# EAGLE design Adafruit 96x64 RGB OLED Breakout v2.0 (EAGLE 6.3)
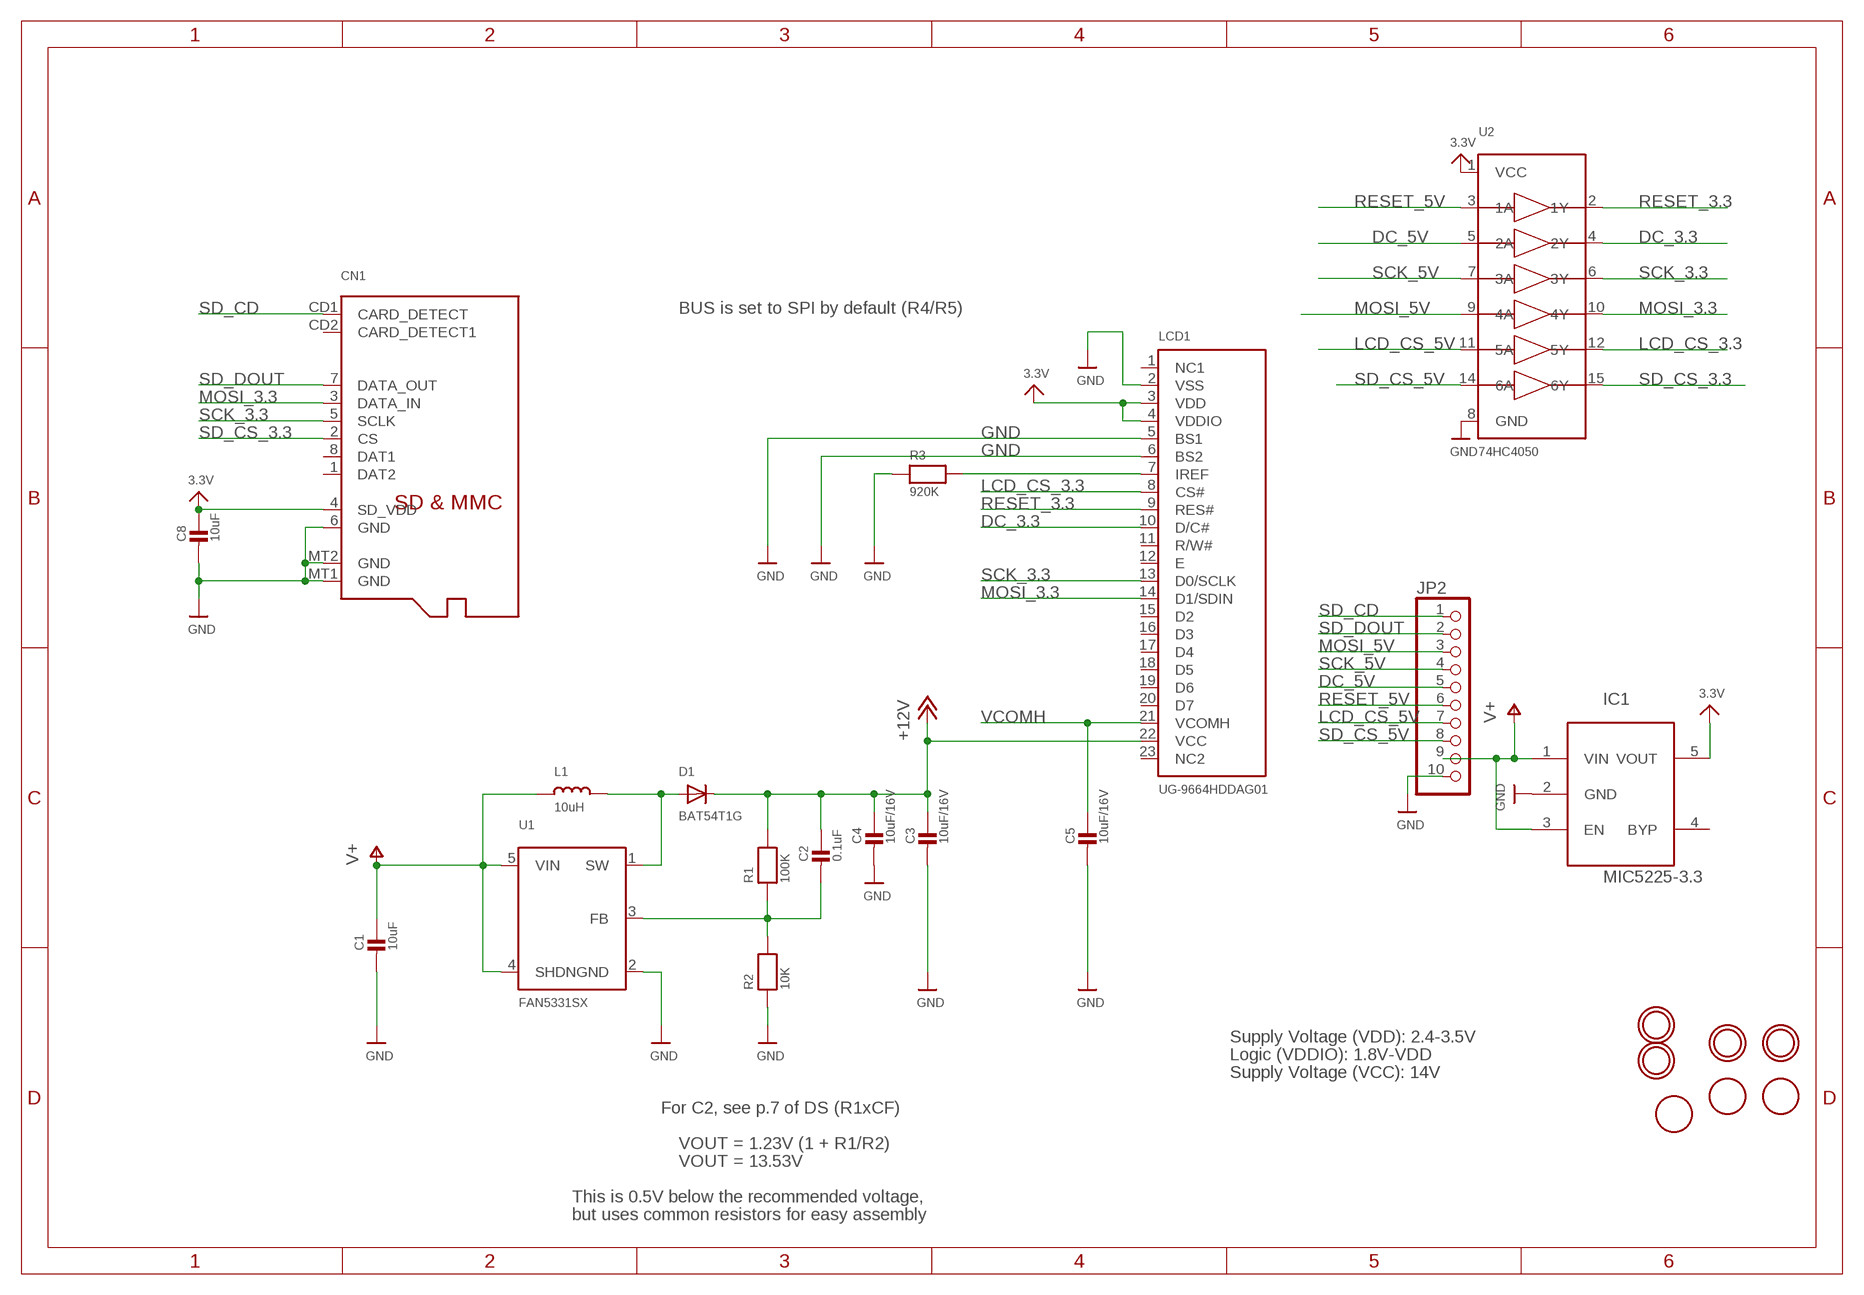
[diagram p0: schematic, sheet 1]

## Parts
C1  10uF  CAP_CERAMIC0805  [0805]
C2  0.1uF  CAP_CERAMIC0805  [0805]
C3  10uF/16V  CAP_CERAMIC0805  [0805]
C4  10uF/16V  CAP_CERAMIC0805  [0805]
C5  10uF/16V  CAP_CERAMIC0805  [0805]
C8  10uF  CAP_CERAMIC0805  [0805]
CN1  MICROSD  [MICROSD]
D1  BAT54T1G  DIODESOD-123  [SOD-123]
IC1  MIC5225-3.3  LP298XS  [SOT23-5L]
JP2  HEADER-1X10THICKER  [1X10_ROUND_76]
L1  10uH  INDUCTOR  [INDUCTOR_1007]
LCD1  UG-9664HDDAG01  DISP_OLED_UG-9664HDDAG01WRAPAROUND  [UG-9664HDDAG01_WRAPAROUND]
R1  100K  RESISTOR0805  [0805]
R2  10K  RESISTOR0805  [0805]
R3  920K  RESISTOR0805  [0805]
U1  FAN5331SX  FAN5331  [SOT23-5]
U2  74HC4050  74HC4050D  [SOIC16]
U$9  MOUNTINGHOLE2.5  [MOUNTINGHOLE_2.5_PLATED]
U$10  MOUNTINGHOLE2.5  [MOUNTINGHOLE_2.5_PLATED]
U$11  MOUNTINGHOLE2.5  [MOUNTINGHOLE_2.5_PLATED]
U$12  FIDUCIAL  [FIDUCIAL_1MM]
U$13  FIDUCIAL  [FIDUCIAL_1MM]
U$15  MOUNTINGHOLE2.5  [MOUNTINGHOLE_2.5_PLATED]
U$16  FIDUCIAL  [FIDUCIAL_1MM]

## Nets
3.3V: C8.1 CN1.4(SD_VDD) IC1.5(VOUT) LCD1.3(VDD) LCD1.4(VDDIO) U2.1(VCC)
+12V: C2.1 C3.1 C4.1 D1.C LCD1.22(VCC) R1.2
DC_3.3: LCD1.10(D/C#) U2.4(2Y)
DC_5V: JP2.5 U2.5(2A)
GND: C1.2 C3.2 C4.2 C5.2 C8.2 CN1.6(GND) CN1.MT1(GND) CN1.MT2(GND) IC1.2(GND) JP2.10 LCD1.2(VSS) LCD1.5(BS1) LCD1.6(BS2) R2.1 R3.1 U1.2(GND) U2.8(GND)
LCD_CS_3.3: LCD1.8(CS#) U2.12(5Y)
LCD_CS_5V: JP2.7 U2.11(5A)
MOSI_3.3: CN1.3(DATA_IN) LCD1.14(D1/SDIN) U2.10(4Y)
MOSI_5V: JP2.3 U2.9(4A)
N$1: D1.A L1.P$2 U1.1(SW)
N$3: C2.2 R1.1 R2.2 U1.3(FB)
N$5: LCD1.7(IREF) R3.2
RESET_3.3: LCD1.9(RES#) U2.2(1Y)
RESET_5V: JP2.6 U2.3(1A)
SCK_3.3: CN1.5(SCLK) LCD1.13(D0/SCLK) U2.6(3Y)
SCK_5V: JP2.4 U2.7(3A)
SD_CD: CN1.CD1(CARD_DETECT) JP2.1
SD_CS_3.3: CN1.2(CS) U2.15(6Y)
SD_CS_5V: JP2.8 U2.14(6A)
SD_DOUT: CN1.7(DATA_OUT) JP2.2
V+: C1.1 IC1.1(VIN) IC1.3(EN) JP2.9 L1.P$1 U1.4(SHDN) U1.5(VIN)
VCOMH: C5.1 LCD1.21(VCOMH)
Unconnected: CN1.1(DAT2) CN1.8(DAT1) CN1.CD2(CARD_DETECT1) IC1.4(BYP) LCD1.1(NC1) LCD1.11(R/W#) LCD1.12(E) LCD1.15(D2) LCD1.16(D3) LCD1.17(D4) LCD1.18(D5) LCD1.19(D6) LCD1.20(D7) LCD1.23(NC2)

## Notes on the sheet
- BUS is set to SPI by default (R4/R5)
- Supply Voltage (VDD): 2.4-3.5V
- Logic (VDDIO): 1.8V-VDD
- Supply Voltage (VCC): 14V
- For C2, see p.7 of DS (R1xCF)
- VOUT = 1.23V (1 + R1/R2)
- VOUT = 13.53V
- This is 0.5V below the recommended voltage,
- but uses common resistors for easy assembly

## Library data of the parts
C1-C5 C8 = microbuilder:CAP_CERAMIC: Ceramic Capacitors For new designs, use the packages preceded by an '_' character since they are more reliable: The following footprints should be used on most boards: _0402 - Standard footprint for regular board layouts _0603 - Standard footprint for regular board layouts _0805 - Standard footprint for regular board layouts For extremely tight-pitch boards where space is at a premium, the following 'micro-pitch' footprints can be used (smaller pads, no silkscreen outline, etc.): _0402MP - Micro-pitch footprint for very dense/compact boards _0603MP - Micro-pitch footprint for very dense/compact boards _0805MP - Micro-pitch footprint for very dense/compact boards Commonly Stocked Parts 0402 - 0402 Surface Mount Capacitors 16pF 50V 5% [Digikey: 445-4899-2-ND] 18pF 50V 5% [Digikey: 490-1281-2-ND] 22pF 50V 5% [Digikey: 490-1283-2-ND] 68pF 50V 5% [Digikey: 490-1289-2-ND] 0.1uF 10V 10% [Digikey: 490-1318-2-ND] 1.0uF 6.3V 10% [Digikey: 490-1320-2-ND] 0603 - 0603 Surface Mount Capacitors 16 pF 50V 5% [Digikey: 445-5051-2-ND] 22 pF 50V [Digikey: PCC220ACVTR-ND] 33 pF 50V 5% [Digikey: 490-1415-1-ND] 56pF 50V 5% [Digikey: 490-1421-1-ND] 220pF 50V 5% [Digikey: 445-1285-1-ND] 680 pF 50V 2200 pF 50V 5% C0G [Digikey: 445-1297-1-ND] 5600 pF 100V 5% X7R [Digikey: 478-3711-1-ND] 0.1 µF 25V 10% [Digikey: PCC2277TR-ND] 0.22 µF 16V 10% X7R [Digikey: 445-1318-1-ND] 1.0 µF 25V 10% [Digikey: 445-5146-2-ND] 0603 - RF Specific 3pF 250V +/-0.1pF RF [Digikey: 712-1347-1-ND] 18 pF 250V 5% [Digikey: 478-3505-1-ND or 712-1322-1-ND] 56 pF 250V 5% C0G RF [Digikey: 490-4867-1-ND] 68 pF 250V RF [Digikey: 490-4868-1-ND] 0805 - 0805 Surface Mount Capacitors 220 pF 250V 2% RF Ceramic Capacitor [Digikey: 712-1398-1-ND] 1000 pF 50V 2% NP0 Ceramic Capacitor [Digikey: 478-3760-1-ND] 0.1 µF 25V 10% Ceramic Capacitor [Digikey: PCC1828TR-ND] 1.0 µF 16V 10% Ceramic Capacitor[Digikey: 490-1691-2-ND] 10.0 µF 10V 10% Ceramic Capacitor[Digikey: 709-1228-1-ND] 10.0 uF 16V 10% Ceramic Capacitor [Digikey: 478-5165-2-ND] 47 uF 6.3V 20% Ceramic Capacitor [Digikey: 587-1779-1-ND or 399-5506-1-ND] 1206 - 1206 Surface Mount Capacitors 47uF 10V 20% Ceramic Capacitor [Digikey: 490-5528-1-ND or 399-5508-1-ND or 445-6010-1-ND] 100uF 6.3V -20%, +80% Y5V Ceramic Capacitor (Digikey: 490-4512-1-ND, Mouser: 81-GRM31CF50J107ZE1L)
CN1 = microbuilder:MICROSD: MicroSD/Transflash Card Holder with SPI pinout 3M: 2908-05WB-MG 4UConnector: 19656 Footprint courtesy: Adafruit Industries
D1 = microbuilder:DIODE: Diode SMA Model Volts Amps Type Vf Vr Digikey # Notes SSA34-E3 40V 3A Schottky 480mV @ 3A 200uA @ 40V SSA34-E3/61TGITR-ND CDBA120-G 20V 1A Schottky 500mV @ 1A 500uA @ 20V 641-1014-6-ND REEL MBRA210 10V 2A Schottky 350mV @ 2A 700uA @ 10V MBRA210LT3 SOD-123 Model Volts Amps Type Vf Vr Order # Notes BAT54T1G 30V 200mA Schottky 800mV @ 200mA 2uA @ 25V BAT54T1GOSTR-ND B0530W 30V 500mA Schottky 430mV @ 500mA 130uA @ 30V B0530W-FDICT-ND REEL MBR120 20V 1A Schottky 340mV @ 1A MBR120VLSFT1GOSCT-ND SOD-323 Model Volts Amps Type Vf Vr Order # Notes PMEG2005EJ 20V 500mA Schottky 355mV @ 500mA 568-4110-1-ND ZLLS410 10V 570mA Schottky 380mV @ 570mA ZLLS410CT-ND 1N4148WS 75V 150mA Silicon/Simple 1V 1N4148WSFSCT-ND REEL SOD-523 Model Volts Amps Type Vf Vr Order # Notes BAT54XV2 30V 200mA Schottky 0.8V @ 100mA BAT54XV2CT-ND TB751S 30V 30mA Schottky RB751S-40TE61CT-ND SOT23-R/W (R = Solder Paste/Reflow Ovens, W = Hand-Soldering) Model Volts Amps Type Vf Vr Order # Notes BAT54FILM 40V 300mA Schottky 497-7162-1-ND
IC1 = adafruit:LP298X
JP2 = microbuilder:HEADER-1X10: PIN HEADER
L1 = microbuilder:INDUCTOR: Inductors 0603: 10nH Ceramic Inductor - microwire antenna/RF (Digikey: 712-1434-2-ND) 0805: 560nH Ceramic Inductor - RF (Digikey: 553-1047-1-ND) 270nH Ceramic Inductor - Q = 40@250MHz, +-5%, 1 Ohm DC Resistance (Digikey: 535-10506-2-ND) 1007 (2518 Metric) SMT: 10µH 10% 250mOhm 820mA 1007 Inductor (Digikey: 587-2189-1-ND) 22µH 10% 500mOhm 580mA 1007 Inductor (Digikey: 587-2190-1-ND) 47µH 10% 950mOhm 420mA 1007 Inductor (Digikey: 587-2191-1-ND) 47µH 5% 100mOhm 1A 1008 Inductor (Digikey: 732-1816-1-ND) 5.0x5.0mm (Taiyo Yuden NR5040 Series) 6.8µH 20% 2.3A 64mOhm Inductor (Digikey: 587-2374-2-ND) 5.0x5.0mm (TDK VLC5045 Series) 4.7µH 20% 3.3A 34mOhm Inductor (Digikey: 445-6526-1-ND) 6.8µH 20% 2.7A 46mOhm Inductor (Digikey: 445-6527-1-ND) 6.0x6.0mm (TDK VLC6045 Series) 4.7µH 20% 3.8A 27mOhm Inductor (Digikey: 445-6538-2-ND) 6.8µH 20% 3A 41mOhm Inductor (Digikey: 445-6540-1-ND) 6.2µH 30% 2.2A 45mOhm Inductor (Digikey: SRR5028-6R2YCT-ND) - Not TDK VLC6045 but footprint should match 6.0x6.0mm (TDK SLF6045 Series) 6.8uH 30% 2A 33mOhm Inductor (Digikey: 445-4572-1-ND, Mouser: 810-SLF645T6R8N2R0PF) 6.0x6.0mm (Sumida CDRH5D28 Series) 6.2uH 30% 1.8A 45mOhm Inductor (Digikey: 308-1542-1-ND) Taiyo Yuden NR3015T2R2M - 2.2uH 20% 1.5A (Digikey: 587-1648-2-ND, Mouser: 963-NR3015T2R2M) - Used with TI TPS62172 CoilCraft RFID Transponder Coil - MA5532-AE (For use with AS3935 Lightning Sensor)
LCD1 = microbuilder:DISP_OLED_UG-9664HDDAG01: OLED 96x64 Pixel, 0.95" 65K Color
R1-R3 = microbuilder:RESISTOR: Resistors For new designs, use the packages preceded by an '_' character since they are more reliable: The following footprints should be used on most boards: _0402 - Standard footprint for regular board layouts _0603 - Standard footprint for regular board layouts _0805 - Standard footprint for regular board layouts For extremely tight-pitch boards where space is at a premium, the following 'micro-pitch' footprints can be used (smaller pads, no silkscreen outline, etc.): _0402MP - Micro-pitch footprint for very dense/compact boards _0603MP - Micro-pitch footprint for very dense/compact boards _0805MP - Micro-pitch footprint for very dense/compact boards
U1 = microbuilder:FAN5331: FAN5331 - LED/OLED 20V Boost Converter Digikey: FAN5331SXCT-ND
U2 = microbuilder:74HC4050D: 6-channel level shifter 74HC4050D - 2V-6V Supply SOIC16 Digikey: 74HC4050D,653-ND Mouser: 771-74HC4050D-T TSSOP16 Digikey: 296-9215-1-ND Mouser:
U$9-U$11 U$15 = microbuilder:MOUNTINGHOLE: Mounting Hole For #2 screws (0.086"/2.18mm width, 0.094"/2.4mm hole) use 2.5mm
U$12 U$13 U$16 = adafruit:FIDUCIAL: For use by pick and place machines to calibrate the vision/machine, 1mm By microbuilder.eu

## Board
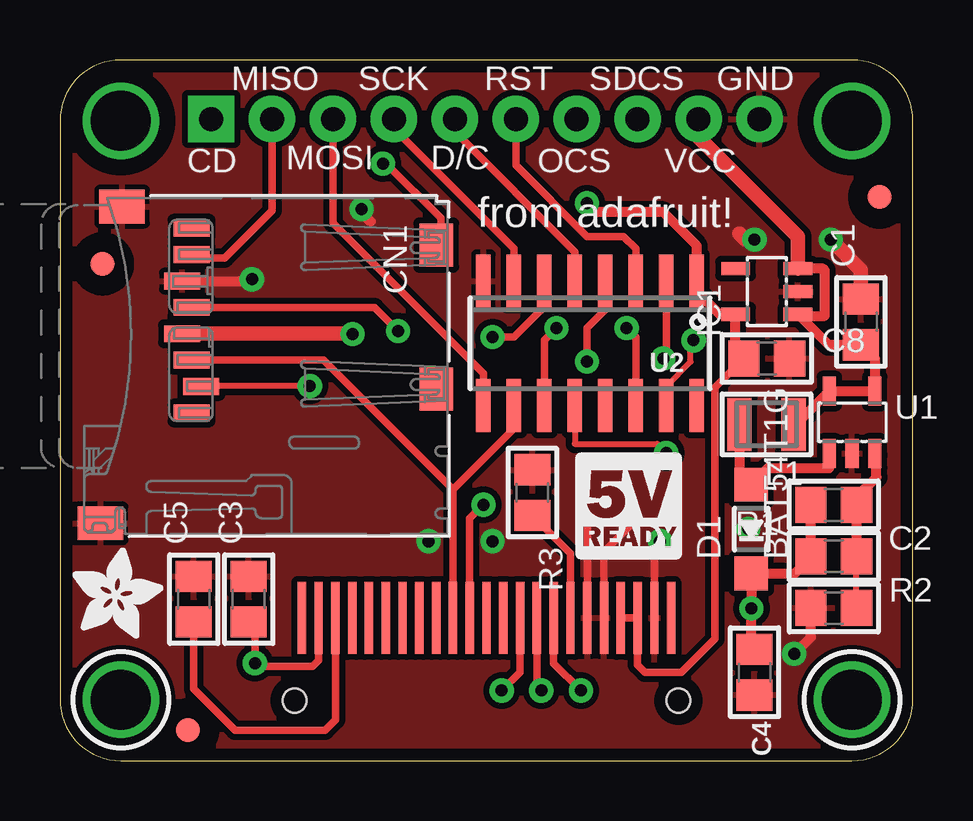
[diagram p1: board, top side]
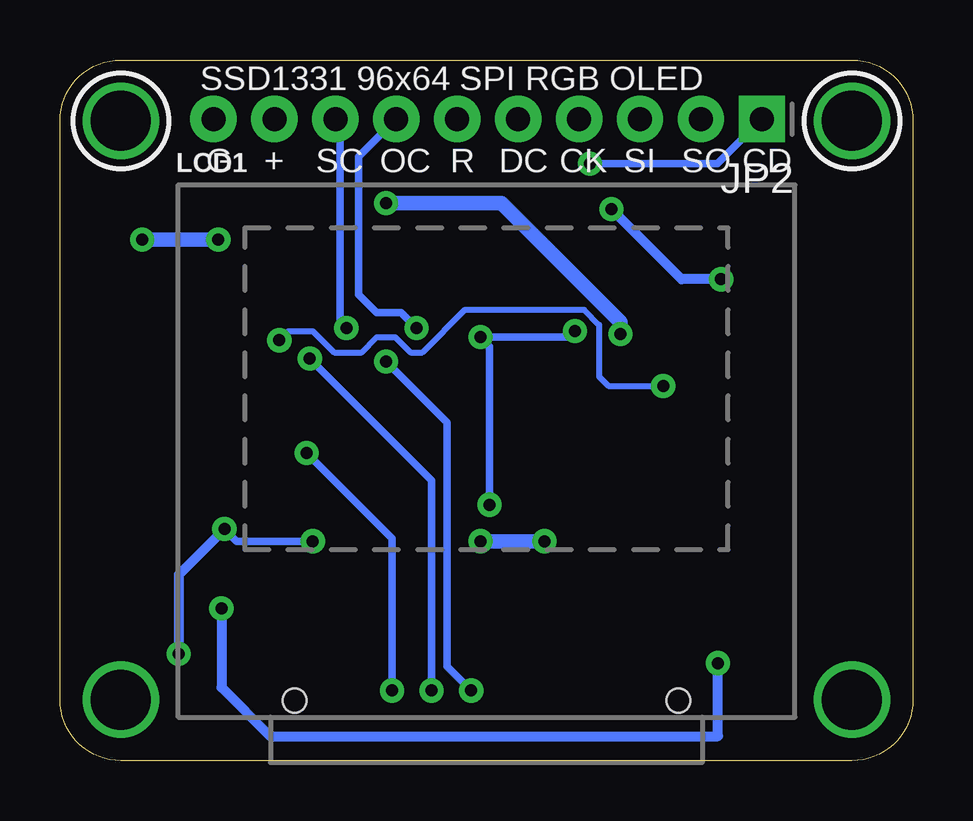
[diagram p2: board, bottom side, seen from below]

Size 35.56 x 29.21 mm. Coordinates in mm from the lower left corner, seen from the top.
Outline: 0,26.67 0,2.54 arc90 2.54,0 33.02,0 arc90 35.56,2.54 35.56,26.67 arc90 33.02,29.21 2.54,29.21 arc90 0,26.67
Copper layers (1*16): Top 0.035mm / dielectric 1.5mm / Bottom 0.035mm
Design rules "pcbcart *": minimum track width 8mil, minimum drill 0.4mm, track to track 10mil, track to pad 10mil, pad to pad 10mil, via to via 10mil, smd to smd 8mil, copper to edge 20mil, drill to drill 8mil, minimum pad ring 8mil, minimum via ring 10mil, stop-mask expansion 3mil, vias tented up to drill 25mil, thermal gap 8mil

### Footprints (pad centres in the part's own frame; a part is rotated, then mirrored left to right if it is on the bottom)
0805 = smd 1.3 x 1.5: 1 -0.95,0; 2 0.95,0
MICROSD = smd 0.7 x 1.5: 1 9,-10.64; 2 7.9,-10.24; 3 6.8,-10.64; 4 5.7,-11.04; 5 4.6,-10.64; 6 3.5,-11.04; 7 2.4,-10.64; 8 1.3,-10.64 | smd 1.8 x 1.4: CD1 2,-0.44; CD2 8,-0.44 | smd 1.4 x 1.9: MT1 0.4,-13.54; MT2 13.6,-14.44
SOD-123 = smd 1.4 x 1.4: A 1.85,0; C -1.85,0
SOT23-5L = smd 0.55 x 1.2: 1 -0.95,-1.3; 2 0,-1.3; 3 0.95,-1.3; 4 0.95,1.3; 5 -0.95,1.3
1X10_ROUND_76 = drill 1 pad 1.93 square: 1 -11.43,0 | drill 1 pad 1.93: 2 -8.89,0; 3 -6.35,0; 4 -3.81,0; 5 -1.27,0; 6 1.27,0; 7 3.81,0; 8 6.35,0; 9 8.89,0; 10 11.43,0
INDUCTOR_1007 = smd 1.016 x 2.2: P$1 -1.127,0; P$2 1.127,0
UG-9664HDDAG01_WRAPAROUND = smd 0.35 x 3 bottom: 1 -7.7,4.138; 2 -7,4.138; 3 -6.3,4.138; 4 -5.6,4.138; 5 -4.9,4.138; 6 -4.2,4.138; 7 -3.5,4.138; 8 -2.8,4.138; 9 -2.1,4.138; 10 -1.4,4.138; 11 -0.7,4.138; 12 0,4.138; 13 0.7,4.138; 14 1.4,4.138; 15 2.1,4.138; 16 2.8,4.138; 17 3.5,4.138; 18 4.2,4.138; 19 4.9,4.138; 20 5.6,4.138; 21 6.3,4.138; 22 7,4.138; 23 7.7,4.138 | hole 1: -8,0.688; 8,0.688
SOT23-5 = smd 0.55 x 1.2: 1 -0.95,-1.3; 2 0,-1.3; 3 0.95,-1.3; 4 0.95,1.3; 5 -0.95,1.3
SOIC16 = smd 0.6 x 2.2: 1 -4.445,-2.6; 2 -3.175,-2.6; 3 -1.905,-2.6; 4 -0.635,-2.6; 5 0.635,-2.6; 6 1.905,-2.6; 7 3.175,-2.6; 8 4.445,-2.6; 9 4.445,2.6; 10 3.175,2.6; 11 1.905,2.6; 12 0.635,2.6; 13 -0.635,2.6; 14 -1.905,2.6; 15 -3.175,2.6; 16 -4.445,2.6
MOUNTINGHOLE_2.5_PLATED = drill 2.5 pad 3.2: P$1 0,0
FIDUCIAL_1MM = smd 1 x 1: 1 0,0

### Placement (x,y rotation side)
C1  33.39,18.29 90 top
C2  32.26,8.52 0 top
C3  7.87,6.73 90 top
C4  28.96,3.68 270 top
C5  5.58,6.73 90 top
C8  29.46,16.76 0 top
CN1  16.13,23.5 270 top
D1  28.82,9.65 90 top
IC1  29.46,19.56 90 top
JP2  17.73,26.75 180 bottom
L1  29.45,14.02 180 top
LCD1  17.78,1.81 0 bottom
R1  32.26,10.66 180 top
R2  32.26,6.36 0 top
R3  19.69,11.18 270 top
U1  33.02,14.11 0 top
U2  22.1,17.4 180 top
U$9  2.54,26.67 0 bottom
U$10  2.54,2.54 0 top
U$11  33.02,26.67 0 bottom
U$12  5.33,1.28 0 top
U$13  1.78,20.71 0 top
U$15  33.02,2.54 0 top
U$16  34.16,23.5 0 top
U$17  [ADAFRUIT_3.5MM]  0.51,5.08 0 top
U$28  [LOGIC_5VREADY_5MM]  21.21,8.13 0 top

### Tracks (layer width: path | path; a pad name or v marks a point on that pad's centre or on a via)
3.3V  (via drill 0.5)
  Top 0.305: LCD1.4 LCD1.3 24.08,3.99 24.38,3.68 25.91,3.68 27.3,5.08 27.3,15.55 C8.1
  Top 0.406: C8.1 28.16,17.11 IC1.5 27.49,18.61 26.54,19.56 U2.1 26.54,21.46 25.15,22.86 22.35,22.86 v21.97,23.24
  Top 0.61: CN1.4 12.18,17.8 v12.19,17.78
  Bottom 0.61: v12.19,17.78 12.19,18.29 17.14,23.24 v21.97,23.24
+12V  (via drill 0.5)
  Top 0.305: LCD1.22 10.78,4.18 10.54,3.94 8.13,3.94 v8.13,4.06 8.13,5.52 C3.1
  Top 0.406: R1.2 C2.1 31.31,8.48 30.63,7.8 D1.C v28.83,6.35 28.83,4.63 C4.1
  Bottom 0.406: v28.83,6.35 28.83,3.05 26.8,1.02 8.13,1.02 v8.13,4.06
DC_3.3  (via drill 0.5)
  Top 0.305: LCD1.10 19.18,3.69 v18.41,2.92 | v21.97,16.64 21.97,18.03 22.73,18.8 U2.4
  Bottom 0.305: v18.41,2.92 19.43,3.94 19.43,14.1 v21.97,16.64
DC_5V
  Top 0.305: JP2.5 16.46,26.21 21.46,21.21 21.46,20.98 U2.5
GND  (via drill 0.5)
  Top 0.305: LCD1.2 24.78,8.9 v25.02,9.14 | LCD1.6 21.98,10.2 | LCD1.5 22.68,8.71 23.88,9.91 23.88,10.54
  Top 0.406: v30.61,4.45 31.31,5.15 R2.1 | CN1.6 7.93,20 v8,20.07 | v12.57,22.99 12.57,22.86 12.95,22.48
  Top 0.61: C1.2 33.39,20.46 v32.13,21.72 | v28.96,21.72 28.57,21.72 28.32,21.97
  Bottom 0.305: v25.02,9.14 28.19,9.14 v28.7,9.65
  Bottom 0.406: v28.7,9.65 30.61,7.75 v30.61,4.45 | v8,20.07 9.65,20.07 v12.57,22.99
  Bottom 0.61: v15.37,9.14 v18.03,9.14 | v32.13,21.72 v28.96,21.72
  pour Top (isolate 0.254): 35.56,29.11 0.1,29.11 0.1,0 35.56,0
LCD_CS_3.3  (via drill 0.5)
  Top 0.254: U2.12 21.46,13.21 24.89,13.21 v25.27,12.83
  Top 0.305: LCD1.8 20.58,4.06 v21.72,2.92
  Bottom 0.305: v21.72,2.92 21.72,9.27 v25.27,12.83
LCD_CS_5V  (via drill 0.5)
  Top 0.305: U2.11 20.19,17.53 v20.7,18.03
  Bottom 0.305: v20.7,18.03 21.34,18.67 22.35,18.67 23.11,19.43 23.11,25.18 JP2.7
MOSI_3.3
  Top 0.305: LCD1.14 16.38,11.3 | 16.38,11.3 18.92,13.84 U2.10 | 16.38,11.3 10.98,16.7 CN1.3
MOSI_5V
  Top 0.305: JP2.3 11.38,22.4 17.65,16.13 U2.9
N$1
  Top 0.406: L1.P$2 28.32,12 D1.A 29.51,12.19 32.07,12.19 U1.1
N$3
  Top 0.254: R2.2 C2.2
  Top 0.406: C2.2 R1.1 33.21,10.98 34.04,11.81 34.04,12.74 U1.3
N$5
  Top 0.305: LCD1.7 21.28,8.64 R3.2
RESET_3.3  (via drill 0.5)
  Top 0.305: LCD1.9 19.88,3.11 v20.07,2.92 | v25.15,16.76 25.27,16.89 U2.2
  Bottom 0.305: v20.07,2.92 20.07,11.68 v25.15,16.76
RESET_5V
  Top 0.305: JP2.6 19,24.82 21.97,21.84 23.5,21.84 24,21.34 U2.3
SCK_3.3  (via drill 0.5)
  Top 0.305: LCD1.13 17.08,10.1 v17.65,10.67 | v18.03,17.65 18.92,17.65 20.19,18.92 U2.6 | CN1.5 13.11,18.89 v14.1,17.91
  Bottom 0.305: v17.65,10.67 17.65,17.27 v18.03,17.65 14.35,17.65 v14.1,17.91
SCK_5V
  Top 0.305: JP2.4 13.92,26.34 18.92,21.34 18.92,20.98 U2.7
SD_CD  (via drill 0.5)
  Top 0.305: v13.46,24.89 13.59,24.89 15.88,22.61 15.88,20.95 15.69,21.14 CN1.CD1
  Bottom 0.305: JP2.1 8.16,24.89 v13.46,24.89
SD_CS_3.3  (via drill 0.5)
  Top 0.254: U2.15 25.27,15.62 26.29,16.64 26.29,17.4 v26.42,17.53 | v10.41,15.62 5.92,15.62 CN1.2
  Bottom 0.254: v26.42,17.53 26.04,17.91 25.02,17.91 24.13,17.02 22.99,17.02 22.35,17.65 21.59,17.65 20.95,17.02 20.45,17.02 18.67,18.8 13.72,18.8 13.08,18.16 13.08,16 12.7,15.62 v10.41,15.62
SD_CS_5V  (via drill 0.5)
  Top 0.305: U2.14 24,17.65 v23.62,18.03
  Bottom 0.305: v23.62,18.03 23.88,18.29 23.88,26.55 JP2.8
SD_DOUT
  Top 0.305: JP2.2 8.84,22.94 6.86,20.95 5.63,20.95 CN1.7
V+
  Top 0.406: IC1.3 31.82,20.51 31.88,20.45 31.88,18.54 30.83,18.54 IC1.1 32.03,17.34 C1.1 33.97,16.76 U1.4 U1.5 30.68,14.02 L1.P$1
  Top 0.61: IC1.3 30.76,21.84 26.62,25.99 JP2.9
VCOMH
  Top 0.305: LCD1.21 11.48,1.7 11.05,1.27 7.3,1.27 5.58,2.99 C5.1

### Text on the board
tPlace: MISO | SCK | RST | SDCS | GND | CD | MOSI | D/C | OCS | VCC | from adafruit!
bPlace: SSD1331 96x64 SPI RGB OLED | CD | SO | SI | CK | DC | R | OC | SC | + | G